# EasyEDA Pro project ProProject_【2023电赛】2023年电赛控制术_2023-08-01.epro, board PCB1
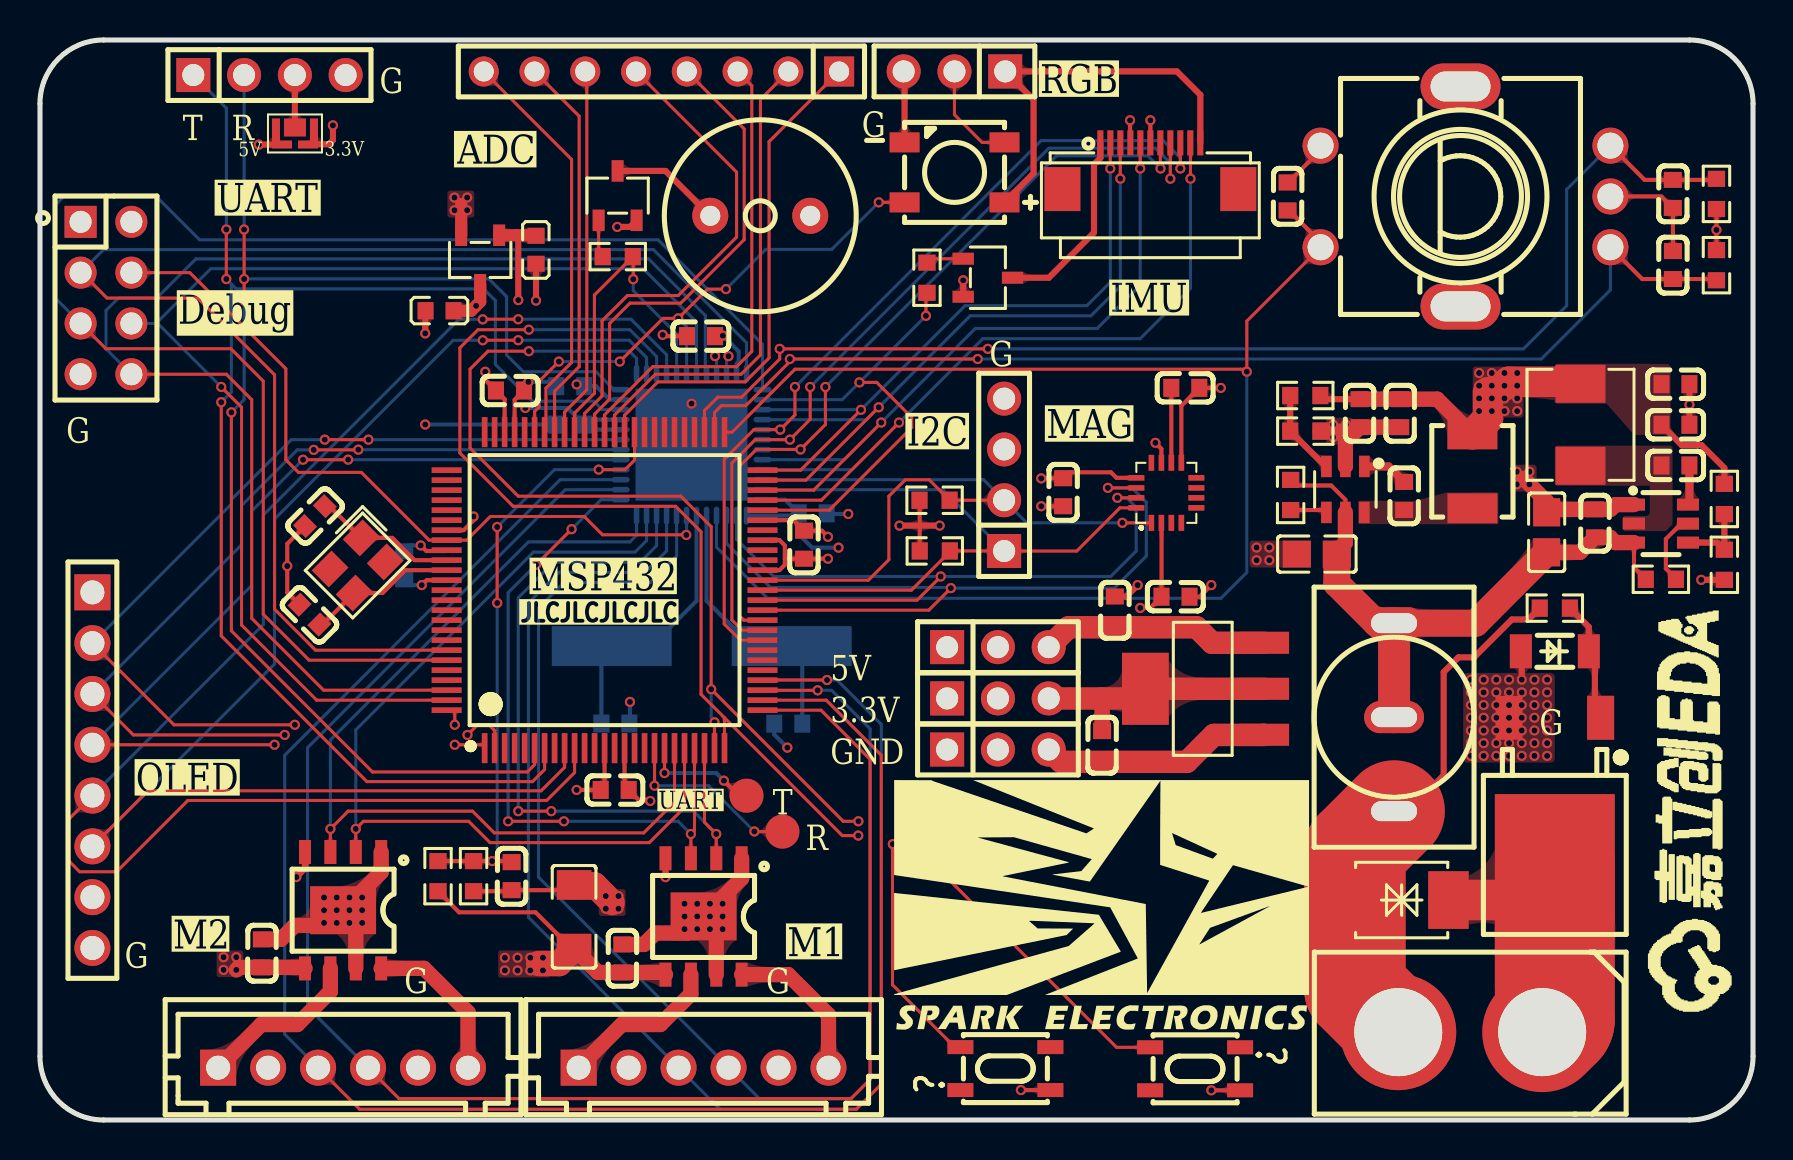
[diagram p6: board, top side]
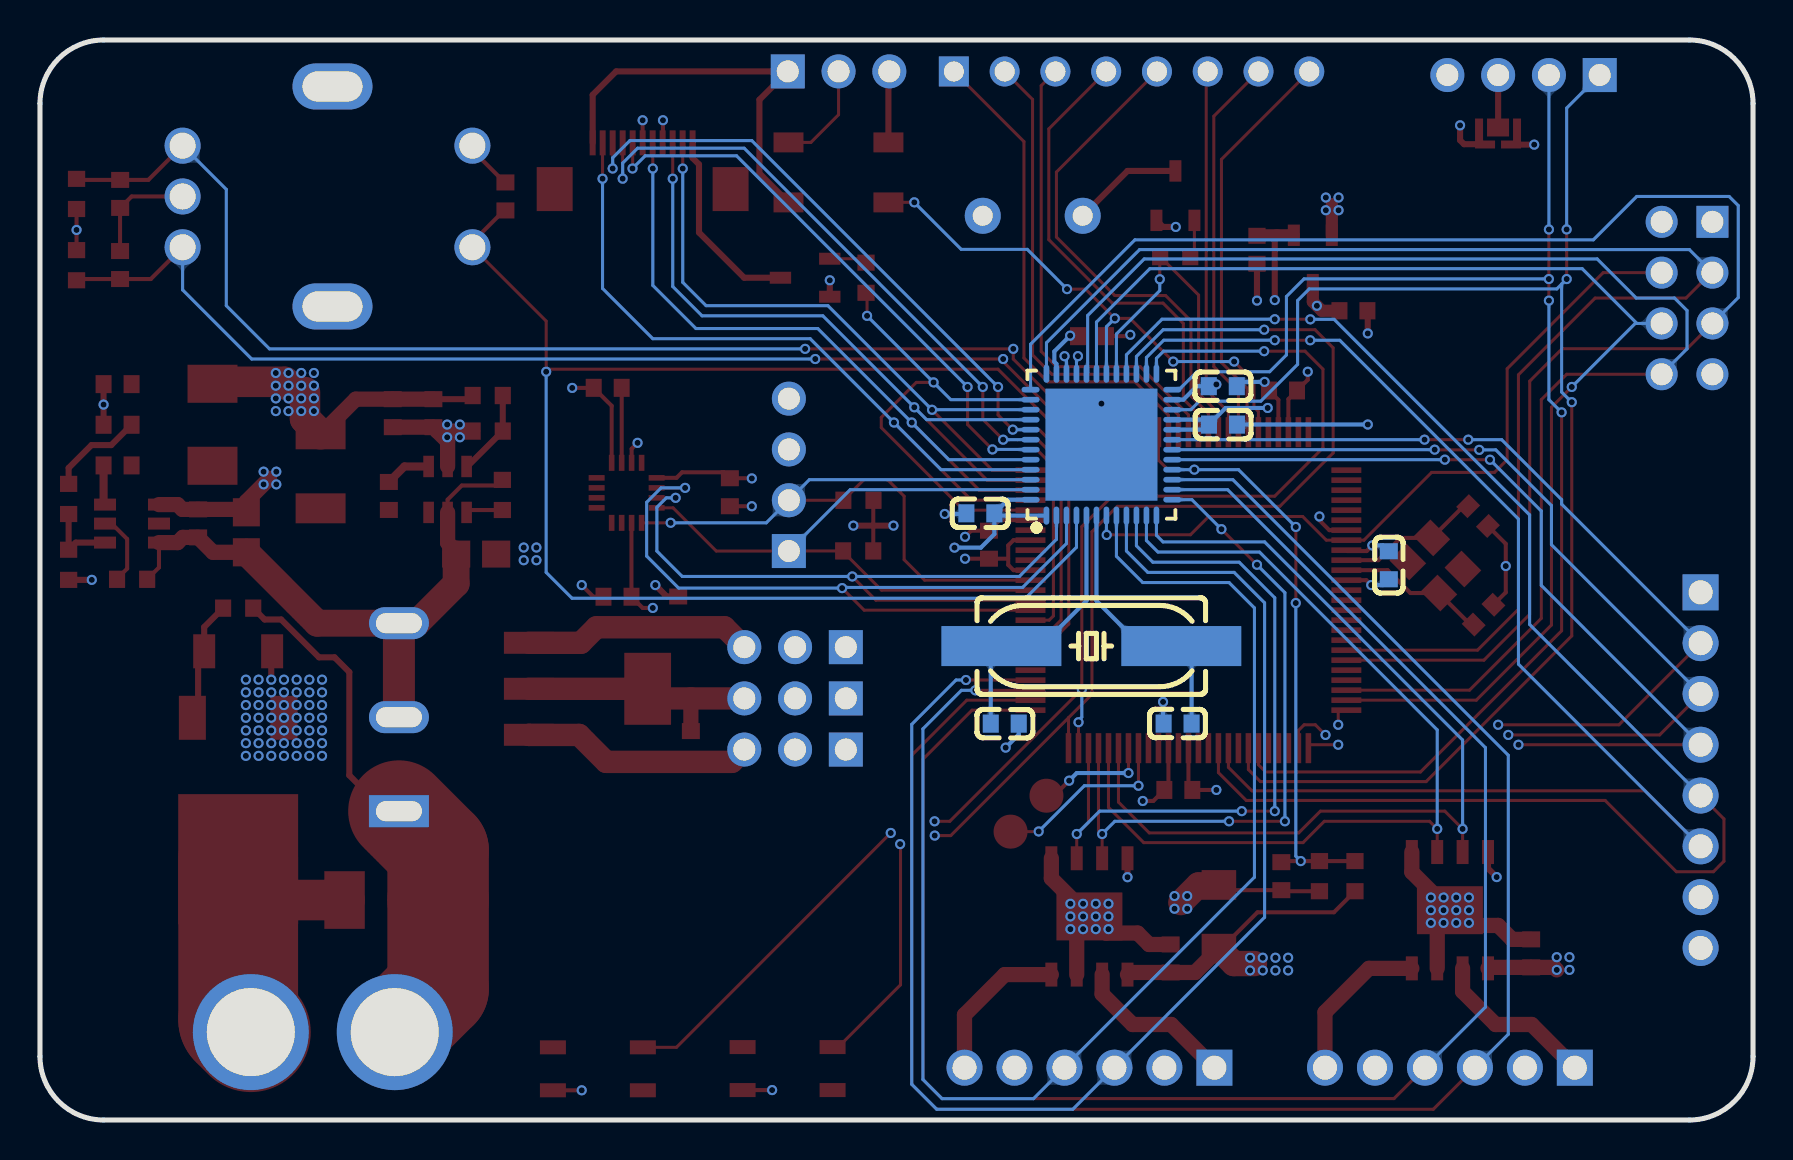
[diagram p7: board, bottom side, seen from below]

Outline 85.7 x 54 mm; copper layers: Top Layer, 电源, 地, Bottom Layer. Coordinates in mm from the lower left corner of the outline.
Outline path: 0,50.82 arc(0.93,53.07) 3.18,54 82.52,54 arc(84.77,53.07) 85.7,50.82 85.7,3.18 arc(84.77,0.93) 82.52,0 3.18,0 arc(0.93,0.93) 0,3.18 0,50.82
Stack: Top Layer 0.035mm 外层铜厚1oz / Dielectric1 0.2104mm 7628 RC49% 8.6mil / 电源 0.0152mm 内层铜厚 / Dielectric2 1.065mm 1.1mm H/HOZ 含铜 / 地 0.0152mm 内层铜厚 / Dielectric3 0.2104mm 7628 RC49% 8.6mil / Bottom Layer 0.035mm 外层铜厚1oz

## Design rules (mm)
template: 自定义配置
spacing copperThickness1oz (default): track to track 0.102, other pairs 0.152 to 0.3
spacing copperThickness2oz: track to track 0.203, other pairs 0.152 to 0.3
track width copperThickness1oz (default): min 0.127, default 0.254, max 100
track width copperThickness2oz: min 0.203, default 0.254, max 2.54
differential pair differentialPair (default): width min 0.127, default 0.254, max 2.54; gap min 0.152, default 0.152
via viaSize (default): diameter min 0.5, default 0.61, max 10; hole min 0.3, default 0.305, max 6.3

## Placement (name value [footprint] x y rotation side)
BUZZER1  3000Hz  [BUZ-TH_BD9.6-P5.00-D0.7-FD]  36.03 45.21 180 top
C1  20pF  [C0603]  13.48 25.27 135 top
C2  20pF  [C0603]  13.76 30.2 225 top
C3  20pF  [C0603]  37.43 19.82 0 bottom
C4  20pF  [C0603]  28.79 19.82 180 bottom
C5  100nF  [C0603]  38.22 28.77 90 top
C6  100nF  [C0603]  18.22 27.74 270 bottom
C7  100nF  [C0603]  26.52 34.77 0 bottom
C8  10uF  [C0603]  33.07 39.19 0 top
C9  100nF  [C0603]  38.65 30.33 180 bottom
C10  100nF  [C0603]  26.53 36.69 0 bottom
C11  100nF  [C0603]  23.51 36.48 180 top
C12  100nF  [C0603]  28.75 16.5 180 top
C13  0.1u  [C0603]  56.81 26.16 0 top
C14  4.7uf  [C0603]  57.3 36.61 0 top
C15  0.1u  [C0603]  51.19 31.39 90 top
C16  0.1u  [C0603]  23.6 12.19 90 top
C17  100nF  [C0603]  81.69 42.75 90 top
C18  100nF  [C0603]  62.41 46.18 270 top
C19  100nF  [C0603]  81.69 46.3 270 top
C20  22uF  [C0805]  75.38 29.39 270 top
C21  100nF  [C0603]  77.79 29.83 270 top
C22  10uF  [C0603]  53.77 25.48 270 top
C23  100nF  [C0603]  68.25 31.2 270 top
C24  22uF  [C0805]  63.88 28.3 0 top
C25  100nF  [C0603]  81.82 32.73 180 top
C26  22uF  [C0603]  66.02 35.34 90 top
C27  10uF  [C0603]  53.14 18.75 90 top
C28  22uF  [C0603]  81.82 34.76 180 top
C29  22uF  [C0603]  68.05 35.34 90 top
C30  22uF  [C0603]  81.82 36.79 180 top
C31  220uf 25v  [C1206]  26.72 10.16 270 top
C32  0.1u  [C0603]  29.13 8.08 270 top
C33  0.1u  [C0603]  11.1 8.33 270 top
CN1  XH2.54-6PIN  [CONN-TH_6P-P2.50-V-M_753]  33.2 2.62 0 top
CN2  XH2.54-6PIN  [CONN-TH_6P-P2.50-V-M_753]  15.16 2.62 0 top
D1  SMBJ15CA  [SMB_L4.5-W3.6-LS5.3-BI]  68.12 11 0 top
D2  ZMM5V1  [LL-34_L3.5-W1.5-RD]  75.78 23.44 180 top
FPC1  0.5K-DX-11PWB  [FPC-SMD_11P-P0.50_DEALON_0.5K-DX-11PWB]  55.55 47.7 0 top
H1  -  [HDR-TH_8P-P2.54-V-F-R2-C4-S2.54-1]  3.3 41.1 270 top
H2  -  [HDR-TH_8P-P2.54-V-F-1]  2.62 17.49 270 top
H3  -  [HDR-TH_4P-P2.54-V-M]  48.23 32.26 90 top
H4  -  [HDR-TH_4P-P2.54-V-M]  11.48 52.25 0 top
H5  -  [HDR-TH_8P-P2.54-V-M]  31.09 52.43 180 top
H6  -  [HDR-TH_3P-P2.54-V-M]  47.92 23.64 0 top
H7  -  [HDR-TH_3P-P2.54-V-M]  47.92 21.08 0 top
H8  -  [HDR-TH_3P-P2.54-V-M]  47.92 18.52 0 top
H9  -  [HDR-TH_3P-P2.54-V-M]  45.75 52.43 180 top
J1  -  [跳线焊盘]  11.41 50.28 0 top
L1  CBG160808U000T  [L0603]  24.82 43.51 90 top
L2  CBG160808U000T  [L0603]  19.99 40.46 0 top
L3  4.7uH  [IND-SMD_L4.5-W4.0-1]  71.66 32.43 90 top
L4  4.7uH  [IND-SMD_L5.4-W5.2]  77.07 34.76 270 top
LED1  XL-5050RGBC-WS2812B  [LED-SMD_4P-L5.0-W5.0-BL_XL-5050RGBC]  45.75 47.38 90 top
Q1  FSS2306  [SOT-23-3_L2.9-W1.6-P1.90-LS2.8-BR]  47.42 42.11 180 top
Q2  FSS2306  [SOT-23-3_L2.9-W1.6-P1.90-LS2.8-BR]  28.9 46.22 270 top
Q3  IRLR7843TRPBF  [TO-252-2_L6.5-W6.1-P4.58-LS10.0-TR]  75.78 16.58 0 top
R1  160R  [R0603]  44.37 42.11 90 top
R2  4.7K  [R0603]  44.76 28.45 0 top
R3  4.7K  [R0603]  44.75 30.99 0 top
R4  330R  [R0603]  83.87 42.74 90 top
R5  330R  [R0603]  83.87 46.3 270 top
R6  160R  [R0603]  28.91 43.17 180 top
R7  30K  [R0603]  19.91 12.19 270 top
R8  10K  [R0603]  21.69 12.19 90 top
R9  10K  [R0603]  62.57 31.25 90 top
R10  100K  [R0603]  75.78 25.59 180 top
R11  10K  [R0603]  81.09 27.04 180 top
R12  270K  [R0603]  63.3 36.22 0 top
R13  50K  [R0603]  63.3 34.44 180 top
R14  54.9K  [R0603]  84.27 31.05 90 top
R15  10K  [R0603]  84.27 27.76 90 top
SW1  TS-1089S-AR02516  [SW-SMD_4P-L4.2-W3.3-P2.15-LS5.1]  48.3 2.57 0 top
SW2  TS-1089S-AR02516  [SW-SMD_4P-L4.2-W3.3-P2.15-LS5.1]  57.79 2.56 0 top
SW3  -  [旋转编码器]  71.04 46.18 90 top
SW4  MB2511S4G01  [KEY-TH_MB2511S4G01]  67.74 20.14 180 top
U1  MSP432P401RIPZR  [QFP-100_L14.0-W14.0-P0.50-LS16.0-BL]  28.25 26.49 0 top
U2  STM32G431CBU6U  [UFQFPN-48_L7.0-W7.0-P0.50-BL-EP5.6]  32.6 33.77 180 bottom
U3  XC6202P332MR  [SOT-23-3_L2.9-W1.6-P1.90-LS2.8-BR]  22.02 43 90 top
U4  -  [VQFN-16_L3.0-W3.0-P0.50-BL-EP1.6]  56.35 31.36 90 top
U5  XT60  [CONN-TH_XT60]  71.55 4.39 180 top
U6  RY8411  [SOT-23-6_L2.9-W1.6-P0.95-LS2.8-TL]  65.31 31.53 270 top
U7  TPS563200DDCR  [SOT-23-6_L2.9-W1.6-P0.95-LS2.8-BR]  81.1 29.82 180 top
U8  AMS1117-3.3  [SOT-223-3_L6.5-W3.4-P2.30-LS7.0-BR]  58.27 21.56 0 top
U9  AT8236  [ESOP-8_L4.9-W3.9-P1.27-LS6.0-BL-EP]  33.2 10.18 180 top
U10  AT8236  [ESOP-8_L4.9-W3.9-P1.27-LS6.0-BL-EP]  15.16 10.49 180 top
U11  -  [2.54 2p触点]  36.25 15.32 135 top
X1  48MHz  [CRYSTAL-SMD_4P-L3.2-W2.5-BL]  15.89 27.73 225 top
X2  8MHz  [HC-49SMD_L11.1-W4.8]  33.1 23.7 180 bottom

## Footprints (pads in the part's own frame, mm; a bottom-side part is the same pattern mirrored in y, then rotated)
2.54 2p触点
  round 1.7 smd: 1(-1.27,0) 2(1.27,0)
BUZ-TH_BD9.6-P5.00-D0.7-FD
  round 1.8 hole 1: 1(-2.5,0) 2(2.5,0)
C0603
  rect 0.8x0.9 smd: 1(-0.7,0) 2(0.7,0)
C0805
  rect 1.41x1.35 smd: 1(-1,0) 2(1,0)
C1206
  rect 1.485x1.728 smd: 1(-1.593,0) 2(1.593,0)
CONN-TH_6P-P2.50-V-M_753
  rect 1.8x1.8 hole 1.2: 1(-6.25,0)
  round 1.8 hole 1.2: 2(-3.75,0) 3(-1.25,0) 4(1.25,0) 5(3.75,0) 6(6.25,0)
CONN-TH_XT60
  round 5.8 hole 4.4: 1(-3.6,0) 2(3.6,0)
CRYSTAL-SMD_4P-L3.2-W2.5-BL
  rect 1.4x1.2 smd: 1(-1.1,-0.85) 2(1.1,-0.85) 3(1.1,0.85) 4(-1.1,0.85)
ESOP-8_L4.9-W3.9-P1.27-LS6.0-BL-EP
  rect 0.6x1.2 smd: 1(-1.905,-2.909) 2(-0.635,-2.909) 3(0.635,-2.909) 4(1.905,-2.909) 5(1.905,2.909) 6(0.635,2.909) 7(-0.635,2.909) 8(-1.905,2.909)
  rect 3.3x2.4 smd: 9(0,0)
FPC-SMD_11P-P0.50_DEALON_0.5K-DX-11PWB
  rect 0.3x1.25 smd: 1(-2.5,1.156) 2(-2,1.156) 3(-1.5,1.156) 4(-1,1.156) 5(-0.5,1.156) 6(0,1.156) 7(0.5,1.156) 8(1,1.156) 9(1.5,1.156) 10(2,1.156) 11(2.5,1.156)
  rect 1.8x2.2 smd: 12(4.4,-1.156) 13(-4.4,-1.156)
HC-49SMD_L11.1-W4.8
  rect 6x2 smd: 1(-4.5,0) 2(4.5,0)
HDR-TH_3P-P2.54-V-M
  rect 1.7x1.7 hole 1.1: 1(-2.54,0)
  round 1.7 hole 1.1: 2(0,0) 3(2.54,0)
HDR-TH_4P-P2.54-V-M
  rect 1.7x1.7 hole 1.1: 1(-3.81,0)
  round 1.7 hole 1.1: 2(-1.27,0) 3(1.27,0) 4(3.81,0)
HDR-TH_8P-P2.54-V-F-1
  rect 1.8x1.8 hole 1.2: 1(-8.89,0)
  round 1.8 hole 1.2: 2(-6.35,0) 3(-3.81,0) 4(-1.27,0) 5(1.27,0) 6(3.81,0) 7(6.35,0) 8(8.89,0)
HDR-TH_8P-P2.54-V-F-R2-C4-S2.54-1
  rect 1.6x1.6 hole 1.1: 1(-3.81,-1.27)
  round 1.6 hole 1.1: 2(-3.81,1.27) 3(-1.27,-1.27) 4(-1.27,1.27) 5(1.27,-1.27) 6(1.27,1.27) 7(3.81,-1.27) 8(3.81,1.27)
HDR-TH_8P-P2.54-V-M
  rect 1.5x1.5 hole 1: 1(-8.89,0)
  round 1.5 hole 1: 2(-6.35,0) 3(-3.81,0) 4(-1.27,0) 5(1.27,0) 6(3.81,0) 7(6.35,0) 8(8.89,0)
IND-SMD_L4.5-W4.0-1
  rect 1.5x2.5 smd: 1(-1.85,0) 2(1.85,0)
IND-SMD_L5.4-W5.2
  rect 1.9x2.5 smd: 1(2.05,0) 2(-2.05,0)
KEY-TH_MB2511S4G01
  rect 2.999x1.6 hole 2.301x1.001: 1(0,4.699)
  oval 2.999x1.6 hole 2.301x1.001: 2(0,0) 3(0,-4.699)
L0603
  rect 0.8x0.864 smd: 1(-0.7,0) 2(0.7,0)
LED-SMD_4P-L5.0-W5.0-BL_XL-5050RGBC
  rect 1x1.5 smd: 1(-1.5,-2.5) 2(1.5,-2.5) 3(1.5,2.5) 4(-1.5,2.5)
LL-34_L3.5-W1.5-RD
  rect 1.1x1.7 smd: 1(-1.7,0) 2(1.7,0)
QFP-100_L14.0-W14.0-P0.50-LS16.0-BL
  rect 0.28x1.5 smd: 1(-6,-7.9) 2(-5.5,-7.9) 3(-5,-7.9) 4(-4.5,-7.9) 5(-4,-7.9) 6(-3.5,-7.9) 7(-3,-7.9) 8(-2.5,-7.9) 9(-2,-7.9) 10(-1.5,-7.9) 11(-1,-7.9) 12(-0.5,-7.9) 13(0,-7.9) 14(0.5,-7.9) 15(1,-7.9) 16(1.5,-7.9) 17(2,-7.9) 18(2.5,-7.9) 19(3,-7.9) 20(3.5,-7.9) 21(4,-7.9) 22(4.5,-7.9) 23(5,-7.9) 24(5.5,-7.9) 25(6,-7.9) 51(6,7.9) 52(5.5,7.9) 53(5,7.9) 54(4.5,7.9) 55(4,7.9) 56(3.5,7.9) 57(3,7.9) 58(2.5,7.9) 59(2,7.9) 60(1.5,7.9) 61(1,7.9) 62(0.5,7.9) 63(0,7.9) 64(-0.5,7.9) 65(-1,7.9) 66(-1.5,7.9) 67(-2,7.9) 68(-2.5,7.9) 69(-3,7.9) 70(-3.5,7.9) 71(-4,7.9) 72(-4.5,7.9) 73(-5,7.9) 74(-5.5,7.9) 75(-6,7.9)
  rect 1.5x0.28 smd: 26(7.9,-6) 27(7.9,-5.5) 28(7.9,-5) 29(7.9,-4.5) 30(7.9,-4) 31(7.9,-3.5) 32(7.9,-3) 33(7.9,-2.5) 34(7.9,-2) 35(7.9,-1.5) 36(7.9,-1) 37(7.9,-0.5) 38(7.9,0) 39(7.9,0.5) 40(7.9,1) 41(7.9,1.5) 42(7.9,2) 43(7.9,2.5) 44(7.9,3) 45(7.9,3.5) 46(7.9,4) 47(7.9,4.5) 48(7.9,5) 49(7.9,5.5) 50(7.9,6) 76(-7.9,6) 77(-7.9,5.5) 78(-7.9,5) 79(-7.9,4.5) 80(-7.9,4) 81(-7.9,3.5) 82(-7.9,3) 83(-7.9,2.5) 84(-7.9,2) 85(-7.9,1.5) 86(-7.9,1) 87(-7.9,0.5) 88(-7.9,0) 89(-7.9,-0.5) 90(-7.9,-1) 91(-7.9,-1.5) 92(-7.9,-2) 93(-7.9,-2.5) 94(-7.9,-3) 95(-7.9,-3.5) 96(-7.9,-4) 97(-7.9,-4.5) 98(-7.9,-5) 99(-7.9,-5.5) 100(-7.9,-6)
R0603
  rect 0.806x0.864 smd: 1(-0.753,0) 2(0.753,0)
SMB_L4.5-W3.6-LS5.3-BI
  rect 2.025x2.883 smd: 1(-2.34,0) 2(2.34,0)
SOT-23-3_L2.9-W1.6-P1.90-LS2.8-BR
  rect 1.07x0.6 smd: 1(1.235,-0.95) 2(1.235,0.95) 3(-1.235,0)
SOT-23-6_L2.9-W1.6-P0.95-LS2.8-BR
  rect 1.1x0.6 smd: 1(1.35,-0.95) 2(1.35,0) 3(1.35,0.95) 4(-1.35,0.95) 5(-1.35,0) 6(-1.35,-0.95)
SOT-23-6_L2.9-W1.6-P0.95-LS2.8-TL
  rect 1.072x0.532 smd: 1(-1.149,0.95) 2(-1.149,0) 3(-1.149,-0.95) 4(1.149,-0.95) 5(1.149,0) 6(1.149,0.95)
SOT-223-3_L6.5-W3.4-P2.30-LS7.0-BR
  rect 2.5x1.1 smd: 1(2.97,-2.3) 2(2.97,0) 3(2.97,2.3)
  rect 2.34x3.6 smd: 4(-2.97,0)
SW-SMD_4P-L4.2-W3.3-P2.15-LS5.1
  rect 1.3x0.701 smd: 1(-2.251,1.075) 2(2.251,1.075) 3(-2.251,-1.075) 4(2.251,-1.075)
TO-252-2_L6.5-W6.1-P4.58-LS10.0-TR
  rect 1.351x2.2 smd: 1(2.291,3.533) 3(-2.291,3.533)
  rect 6x6.5 smd: 4(0,-3.533)
UFQFPN-48_L7.0-W7.0-P0.50-BL-EP5.6
  oval 0.28x0.9 smd: 1(-2.751,-3.547) 2(-2.251,-3.547) 3(-1.75,-3.547) 4(-1.25,-3.547) 5(-0.75,-3.547) 6(-0.249,-3.547) 7(0.249,-3.547) 8(0.75,-3.547) 9(1.25,-3.547) 10(1.75,-3.547) 11(2.251,-3.547) 12(2.751,-3.547) 25(2.751,3.547) 26(2.251,3.547) 27(1.75,3.547) 28(1.25,3.547) 29(0.75,3.547) 30(0.249,3.547) 31(-0.249,3.547) 32(-0.75,3.547) 33(-1.25,3.547) 34(-1.75,3.547) 35(-2.251,3.547) 36(-2.751,3.547)
  oval 0.9x0.28 smd: 13(3.547,-2.75) 14(3.547,-2.25) 15(3.547,-1.75) 16(3.547,-1.25) 17(3.547,-0.75) 18(3.547,-0.25) 19(3.547,0.25) 20(3.547,0.75) 21(3.547,1.25) 22(3.547,1.75) 23(3.547,2.25) 24(3.547,2.75) 37(-3.547,2.751) 38(-3.547,2.251) 39(-3.547,1.75) 40(-3.547,1.25) 41(-3.547,0.75) 42(-3.547,0.249) 43(-3.547,-0.249) 44(-3.547,-0.75) 45(-3.547,-1.25) 46(-3.547,-1.75) 47(-3.547,-2.251) 48(-3.547,-2.751)
  rect 5.6x5.6 smd: 49(0,0)
VQFN-16_L3.0-W3.0-P0.50-BL-EP1.6
  rect 0.8x0.28 smd: 1(-1.501,0.75) 2(-1.501,0.249) 3(-1.501,-0.249) 4(-1.501,-0.75) 9(1.501,-0.75) 10(1.501,-0.249) 11(1.501,0.249) 12(1.501,0.75)
  rect 0.28x0.8 smd: 5(-0.75,-1.501) 6(-0.249,-1.501) 7(0.249,-1.501) 8(0.75,-1.501) 13(0.75,1.501) 14(0.249,1.501) 15(-0.249,1.501) 16(-0.75,1.501)
旋转编码器
  oval 2.301x4 hole 1.501x2.999: 6(5.499,-0.023) 7(-5.499,-0.023)
  round 1.801 hole 1.3: A(-2.54,-7.521) B(2.54,-7.521) C(0,-7.521) D(-2.54,6.977) E(2.54,6.977)
跳线焊盘
  custom 1.1x0.9 smd: 1(1.35,-0.65)
  custom 1x1.5 smd: 2(0.7,-1.5) 3(2,-1.5)

## Nets
As in the schematic.

Pads without a net: FPC1 12 13; H1 2; H2 1; SW1 2 3; SW2 2 3; U1 12 14 41 42 44 92 93; U4 3 4 5 6 7 8 12; X1 2 4

## Via types
v1: diameter 0.508, hole 0.305, Top Layer to Bottom Layer, 257 vias

## Routing (per net, layer and track width the routed paths; a pad name or vN(x,y) marks a point on that pad's centre or on a via; arc(x,y) is an arc through that point)
AVCC: length 51.7
  Top Layer w0.203: U1.45 37.7,29.99 C5.2 39.11,29.47 v1(39.42,29.16) ; U1.87 19.35,26.99 v1(19.1,26.75)
  Top Layer w0.305: v1(24.82,40.97) L1.1
  电源 w0.305: 28.43,37.36 36.63,29.16 v1(39.42,29.16) ; 28.43,37.36 v1(24.82,40.97) ; 28.43,37.36 28.43,37.34 26.69,35.6 v1(24.28,35.6) 24.28,29.61 21.41,26.75 v1(19.1,26.75)
  Bottom Layer w0.203: C6.2 18.51,26.75 v1(19.1,26.75) ; v1(24.28,35.6) 26.39,35.6 C7.2 ; C7.2 27.47,34.52 U2.20 ; C7.2 27.46,35.02 U2.21
AVSS: length 66.2
  Top Layer w0.203: U1.43 37,28.99 37.26,28.73 37.26,27.76 37,27.49 U1.40 ; v1(19.27,34.77) 19.27,34.78 19.22,34.78 ; v1(39.42,28.06) C5.1 37.26,28.06 ; v1(19.05,28.73) 19.33,28.45 20.3,28.45 U1.84
  Top Layer w0.305: v1(19.27,39.33) 19.27,40.45 L2.1
  电源 w0.305: v1(39.42,28.06) 35.41,28.06 27.99,20.65 27.99,16.59 27.23,15.82 26.47,15.82 25.7,16.59 25.7,19 23.04,21.67 19.23,21.67 17.65,23.24 17.65,27.33 v1(19.05,28.73) 19.27,28.95 v1(19.27,39.33)
  Bottom Layer w0.203: v1(19.27,34.77) 25.81,34.77 C7.1 ; C6.1 18.51,28.73 v1(19.05,28.73)
D3.3V: length 280.9
  Top Layer w0.203: FPC1.6 v1(55.55,49.99) ; v1(55.04,25.6) 55.55,25.6 C13.1 56.11,29.85 U4.2 ; R2.1 44.01,30.98 R3.1 ; R4.2 v1(83.87,44.5) R5.2 ; U4.13 53.86,32.11 53.58,32.39 51.48,32.39 C15.2 50.1,32.09 v1(50.09,32.08)
  Top Layer w0.305: v1(43,29.72) 44,29.72 44.01,29.73 44.03,29.72 v1(45.01,29.72) ; v1(14.66,49.73) 14.66,48.99 14.46,48.79 13.68,48.79 ; v1(12.82,12.15) 13.26,12.58 U10.4 ; U9.4 v1(31.29,12.14)
  Top Layer w0.762: 53.14,21.08 53.14,21.08 53.14,19.44
  Top Layer w1.117: H7.3 54.82,21.08 U8.4 U8.2
  电源 w0.508: 52.25,28.4 52.25,29.92 v1(50.09,32.08) ; 52.25,28.4 v1(55.04,25.6) ; 52.25,28.4 50.72,26.87 46.91,26.87 46.03,27.76 46.03,28.7 v1(45.01,29.72) ; v1(55.55,49.99) 56.06,50.5 66.6,50.5 78.34,38.75 78.73,38.75 83.87,43.89 v1(83.87,44.5) ; v1(43,29.72) 42.22,29.72 42.15,29.78
  电源 w0.61: v1(14.66,49.73) 10.46,49.73 9.32,48.59 9.32,47.07 ; H2.7 8.1,5.66 14.46,5.66 ; 14.46,5.66 26.4,5.66 CN1.2 ; 14.46,5.66 CN2.2
  电源 w0.762: H7.3 61.11,21.08 78.35,38.31 78.35,38.75 ; H1.1 2.04,44.91 3.85,46.72 8.97,46.72 9.32,47.07 9.64,46.75 11.04,46.75 14.43,43.36 34.75,43.36 40.18,37.93 40.18,33.86 42.15,31.89 42.15,24.31 H7.1 44.17,21.08 35.23,12.14 v1(31.29,12.14) 3.62,12.14 H2.7
  电源 w1.778: H7.1 H7.2 H7.3
D5V: length 161.9
  Top Layer w0.305: FPC1.11 58.05,51.26 56.88,52.43 H9.1 49.71,51.01 49.71,47.33 LED1.1 ; 84.27,31.81 84.27,32.6 83.12,33.75 82.13,33.75 C28.2 ; v1(10.95,48.77) 12.1,48.77 J1.2 ; R12.2 64.24,36.04 C26.2
  Top Layer w0.61: U3.2 21.07,45.8
  Top Layer w0.762: C26.2 C29.2 69.9,36.04 L3.2
  Top Layer w1.117: H6.3 51.46,24.64 57.86,24.64 58.64,23.86 U8.3
  Top Layer w1.524: L3.2 72.44,35.06 72.44,36.4 ; v1(73.27,36.72) 73.46,36.91 76.97,36.91 L4.2
  电源 w0.508: v1(20.74,46.12) 20.74,46.14 18.11,48.77 v1(10.95,48.77)
  电源 w0.61: 44.03,33.55 44.05,33.53 H3.3
  电源 w1.016: 44.03,37.32 44.03,25 H6.1 ; 44.03,37.32 38.53,42.81 BUZZER1.1 36.68,47.07 22.33,47.07 21.06,45.8 ; 44.03,37.32 48.29,41.58 H9.1
  电源 w1.778: 72.82,35.89 60.57,23.64 H6.3 H6.2 H6.1
  vias: v1(20.74,45.49) v1(21.37,46.12) v1(21.37,45.49) v1(72,37.35) v1(72,36.72) v1(72,36.08) v1(72,35.45) v1(72.63,37.35) v1(72.63,36.72) v1(72.63,36.08) v1(72.63,35.45) v1(73.27,37.35) v1(73.27,36.08) v1(73.27,35.45) v1(73.9,37.35) v1(73.9,36.72) v1(73.9,36.08) v1(73.9,35.45)
D12V: length 31.9
  Top Layer w0.203: U7.3 79.75,27.63 R11.2 ; R9.2 62.85,31.72 64.6,31.72 65.31,31.02 U6.5
  Top Layer w0.762: U6.5 65.31,28.86 64.88,28.44 C24.2 ; C20.2 77.04,28.39 C21.2 78.56,29.13 78.81,28.87 U7.3
  Top Layer w1.346: C24.2 64.88,26.81 66.85,24.84 SW4.3 71.83,24.84 C20.2
  Top Layer w1.6: SW4.2 SW4.3
DVCC: length 89.6
  Top Layer w0.203: v1(26.85,16.5) 28.05,16.5 28.25,16.7 U1.13 ; v1(22.28,37.41) 22.28,37.01 C11.2 23.25,36.04 U1.73 ; 33.77,39.19 34.14,39.19 v1(34.16,39.22)
  Top Layer w0.305: v1(23.93,41) 23.93,44.13 23.82,44.24
  Top Layer w0.61: U3.1 24.79,44.24 L1.2
  电源 w0.305: v1(39.95,28.62) 40.18,28.85 40.18,29.49 33.11,36.56 33.11,38.6 33.73,39.22 v1(34.16,39.22) ; v1(26.85,36.78) 26.34,36.27 22.28,36.27 ; v1(34.16,39.22) 32.61,40.77 29.84,40.77 29.01,41.61 24.54,41.61 v1(23.93,41) 23.04,40.11 23.04,38.18 v1(22.28,37.41) 22.28,36.27 ; v1(34.16,39.22) 34.11,39.16 ; v1(26.85,16.5) 26.85,19 23.42,22.43 19.48,22.43 18.34,23.57 18.34,27 18.97,27.64 20.88,27.64 22.28,29.03 22.28,36.27
  Bottom Layer w0.203: v1(26.85,36.78) 27.14,36.78 C10.2 27.82,36.69 28.5,36.02 U2.23 ; U2.48 37.27,31.02 C9.2 ; 34.85,37.32 34.85,37.81 34.95,37.91 34.95,38.43 v1(34.16,39.22) ; C9.2 37.95,29.29 38.63,28.62 v1(39.95,28.62) ; C9.2 37.84,30.22 U2.1
GND: length 108.6
  Top Layer w0.203: C2.2 12.37,28.81 v1(12.37,27.7) 12.37,26.38 12.99,25.76 ; SW1.4 v1(49.07,1.5) ; U1.15 29.25,16.71 C12.1 30,15.95 v1(30.53,15.95) ; v1(24.44,36.91) 24.21,36.68 C11.1 23.75,36.01 U1.72 ; C31.1 26.46,11.49 C16.1 23.54,11.44 R8.1 ; v1(31.15,39.26) 31.22,39.19 32.37,39.19 ; v1(21.69,30.17) 21.69,29.99 21.2,29.49 U1.82 ; v1(55.8,33.86) 56.1,33.56 U4.11 ; FPC1.4 54.53,48.87 v1(54.53,49.99) ; C17.2 81.69,45.6 C19.2 81.11,46.18 78.56,46.18 ; v1(58.6,1.49) 60.04,1.49 ; v1(59.07,36.6) 58,36.6 C14.2 57.1,35.71 U4.9 ; C13.2 58.02,26.16 v1(58.6,26.75) ; 62.41,46.88 62.45,46.88 64.07,48.5 64.07,48.72 ; C15.1 v1(50.09,30.69)
  Top Layer w0.305: 72.9,22.06 v1(72.86,22.02) ; v1(54.91,26.75) 54.34,26.18 C22.1 ; C30.1 v1(82.52,35.77) C28.1 ; H9.3 43.25,52.39 LED1.3 ; Q1.2 v1(46.19,41.99) ; 29.85,44.98 29.52,44.65 v1(28.88,44.65) ; v1(74.13,22.02) 74.13,23.39 D2.2 ; 84.27,27.01 v1(83.11,27.01)
  Top Layer w0.61: L2.2 21.57,40.46 v1(21.82,40.71) 22.02,40.91 U3.3
  Top Layer w0.762: U9.1 35.1,12.08 U9.9 ; 74.22,32.08 75.38,30.92 C20.1 75.52,30.53 C21.1 78.57,30.53 78.81,30.77 U7.1 ; U9.9 32.37,9.35 30.78,9.35 30.22,8.78 C32.1 ; U9.9 33.83,9.54 U9.7 ; U10.1 17.07,12.39 U10.9 ; U6.2 65.31,33.93 65.82,34.44 ; R13.1 65.82,34.44 ; 65.82,34.44 C26.1 C29.1 ; U10.7 15.8,9.86 U10.9 ; U10.9 14.4,9.73 12.75,9.73 12.05,9.03 11.1,9.03
  Top Layer w1.117: H8.3 51.08,17.91 57.38,17.91 58.72,19.25 61.23,19.25 U8.1
  Top Layer w1.27: 28.63,10.87 27.74,11.75 C31.1
  Bottom Layer w0.203: C4.1 29.51,19.85 v1(29.51,20.9) ; v1(50.09,30.69) 50.09,30.68 ; C9.1 39.39,30.3 v1(40.44,30.3) ; v1(24.44,36.91) 25.61,36.91 C10.1 ; v1(37.39,18.62) 36.73,19.27 C3.1
  vias: v1(14.21,11.12) v1(14.21,10.49) v1(14.21,9.86) v1(14.85,11.12) v1(14.85,10.49) v1(14.85,9.86) v1(15.48,11.12) v1(15.48,10.49) v1(15.48,9.86) v1(16.12,11.12) v1(16.12,10.49) v1(16.12,9.86) v1(28.31,11.2) v1(28.31,10.56) v1(28.94,11.2) v1(28.94,10.56) v1(32.25,10.81) v1(32.25,10.18) v1(32.25,9.54) v1(32.6,35.82) v1(32.88,10.81) v1(32.88,10.18) v1(32.88,9.54) v1(33.52,10.81) v1(33.52,10.18) v1(33.52,9.54) v1(34.15,10.81) v1(34.15,10.18) v1(34.15,9.54) v1(60.86,28.62) v1(60.86,27.99) v1(61.5,28.62) v1(61.5,27.99) v1(64.69,34.77) v1(64.69,34.14) v1(65.33,34.77) v1(65.33,34.14) v1(71.59,22.02) v1(71.59,21.38) v1(71.59,20.75) v1(71.59,20.11) v1(71.59,19.48) v1(71.59,18.84) v1(71.59,18.21) v1(72.22,22.02) v1(72.22,21.38) v1(72.22,20.75) v1(72.22,20.11) v1(72.22,19.48) v1(72.22,18.84) v1(72.22,18.21) v1(72.86,21.38) v1(72.86,20.75) v1(72.86,20.11) v1(72.86,19.48) v1(72.86,18.84) v1(72.86,18.21) v1(73.49,22.02) v1(73.49,21.38) v1(73.49,20.75) v1(73.49,20.11) v1(73.49,19.48) v1(73.49,18.84) v1(73.49,18.21) v1(73.88,32.42) v1(73.88,31.78) v1(74.13,21.38) v1(74.13,20.75) v1(74.13,20.11) v1(74.13,19.48) v1(74.13,18.84) v1(74.13,18.21) v1(74.51,32.42) v1(74.51,31.78) v1(74.76,22.02) v1(74.76,21.38) v1(74.76,20.75) v1(74.76,20.11) v1(74.76,19.48) v1(74.76,18.84) v1(74.76,18.21) v1(75.4,22.02) v1(75.4,21.38) v1(75.4,20.75) v1(75.4,20.11) v1(75.4,19.48) v1(75.4,18.84) v1(75.4,18.21)
ACCCS_PC11: length 35.2
  Top Layer w0.152: v1(54.04,47.07) 54.04,48.85 FPC1.3 ; U1.49 38.32,31.99 v1(41.96,35.64)
  Bottom Layer w0.152: U2.40 41.34,35.02 v1(41.96,35.64) 46.53,40.21 52.58,40.21 54.04,41.68 v1(54.04,47.07)
ACCEXT_PC10: length 33.2
  Top Layer w0.152: U1.50 38.06,32.49 v1(41.07,35.51) ; FPC1.2 53.54,48.85 v1(53.54,47.57)
  Bottom Layer w0.152: v1(53.54,47.57) 53.54,41.89 52.38,40.72 46.28,40.72 41.08,35.52 ; v1(41.07,35.51) 41.08,35.52 ; 41.08,35.52 U2.39
ADCBAT_PC4: length 31.3
  Top Layer w0.152: v1(27.95,32.52) 29.27,32.52 29.75,32.99 U1.60 29.77,34.37 ; v1(22.87,25.85) 22.87,25.85 22.87,29.65 v1(22.87,29.65)
  Top Layer w0.203: C16.2 23.54,12.94 v1(22.63,12.94) 19.91,12.94
  Bottom Layer w0.152: v1(22.87,29.65) 25.74,32.52 U2.16 ; v1(22.63,12.94) 22.87,13.19 v1(22.87,25.85)
B12V: length 105.9
  Top Layer w0.203: C31.2 26.61,8.57 24.79,10.39 20.97,10.39 R7.2
  Top Layer w0.305: SW4.1 68.43,15.44 70.23,17.24 70.23,22.4 70.96,23.13 71.74,23.13 73.63,25.03 74.46,25.03 R10.2
  Top Layer w0.762: U10.5 13.21,7.63 C33.2 ; U9.5 31.19,7.38 C32.2 27.91,7.38 C31.2 ; v1(9.82,7.51) 9.95,7.63 11.07,7.63
  Top Layer w1.27: 24.94,7.82 25.98,7.82 C31.2
  Top Layer w5.08: U5.2 65.78,6.56 D1.1 65.78,13.48 SW4.1
  电源 w1.778: U5.2 64.52,7.82 9.45,7.82
  vias: v1(9.18,8.14) v1(9.18,7.51) v1(9.82,8.14) v1(23.26,8.11) v1(23.26,7.48) v1(23.89,8.11) v1(23.89,7.48) v1(24.53,8.11) v1(24.53,7.48) v1(25.16,8.11) v1(25.16,7.48)
BTN1_PC15: length 77.5
  Top Layer w0.152: U1.51 34.62,34.39 37.77,37.54 60.25,37.54 v1(60.38,37.41) 60.38,39.95 SW3.D
  Top Layer w0.203: SW3.D 64.07,43.89 62.48,45.48 C18.2
  Bottom Layer w0.152: U2.4 33.85,28.64 36.4,26.09 59.08,26.09 60.38,27.38 v1(60.38,37.41)
BTN2_PB14: length 64.7
  Top Layer w0.152: SW1.1 45.76,3.65 42.65,6.76 42.65,13.77 v1(42.67,13.79) ; v1(40.94,14.22) 40.13,14.22 34.25,20.11 ; U1.25 34.25,20.11 ; 34.25,20.11 33.07,21.28 33.07,29.41 31.8,30.68 23.67,30.68 21.01,33.35 21.01,38.61 21.91,39.52 v1(24.46,39.52)
  电源 w0.152: v1(42.67,13.79) 42.67,13.8 42.24,14.22 v1(40.94,14.22)
  Bottom Layer w0.152: U2.27 30.85,38.17 29.51,39.51 24.46,39.51
BTN3_PB12: length 67.9
  Top Layer w0.152: v1(43.14,14.35) 53.86,3.63 SW2.1 ; v1(24.46,38.44) 22.41,38.44 21.51,37.54 21.51,33.6 23.93,31.19 32.06,31.19 33.58,29.67 v1(33.58,21.54) 40.18,14.94 v1(40.94,14.94) ; U1.24 v1(33.75,19.89)
  电源 w0.152: v1(40.94,14.94) 42.56,14.94 43.14,14.36 v1(43.14,14.35)
  Bottom Layer w0.152: 24.46,38.44 29.49,38.44 29.85,38.08 U2.25 ; v1(33.58,21.54) 33.58,20.14 33.83,19.89 v1(33.75,19.89)
BUZZ_PC6: length 16.7
  Top Layer w0.152: v1(29.68,42.04) 29.68,43.15 R6.1 27.74,41.25 27.74,36.34 26.75,35.34 U1.66
  Bottom Layer w0.152: v1(29.68,42.04) 29.68,41.47 31.85,39.3 U2.29
DIR1_PA5: length 34
  Top Layer w0.152: v1(26.59,29.54) v1(24.82,27.76) ; U1.22 32.75,14.48 v1(32.56,14.3) 32.56,13.09 ; v1(23.42,14.94) v1(26.21,14.94)
  Bottom Layer w0.152: v1(23.42,14.94) 23.42,26.36 v1(24.82,27.76) ; U2.13 28.07,31.02 v1(26.59,29.54) ; v1(26.21,14.94) 31.93,14.94 v1(32.56,14.3)
DIR2_PA4: length 47.5
  Top Layer w0.152: U1.20 31.75,15.89 30.21,14.36 22.73,14.36 21.64,15.44 15.42,15.44 v1(14.53,14.55) 14.53,13.4
  Bottom Layer w0.152: U2.12 29.85,29.24 29.51,28.91 24.44,28.91 14.53,19 v1(14.53,14.55)
ENCOA1_PA0: length 68.8
  Top Layer w0.152: U1.28 36.15,21.48 v1(38.91,21.48)
  Bottom Layer w0.152: v1(38.91,21.48) 39.6,21.48 41.53,19.56 41.53,2.03 40.57,1.07 36,1.07 CN1.4 34.45,2.64 24.94,12.14 24.94,25.6 26.21,26.87 30.53,26.87 31.85,28.19 U2.8
ENCOA2_PA6: length 86.8
  Top Layer w0.152: CN2.4 17.96,1.07 40.57,1.07 41.53,2.03 41.53,18.03 39.07,20.49 U1.26
  Bottom Layer w0.152: U2.14 26.28,31.52 13.39,18.62 13.39,5.64 CN2.4
ENCOA3_PA11: length 66.1
  Top Layer w0.152: v1(47.42,38.56) v1(37.01,38.56) 37.01,38.05 35.1,36.14 33.91,36.14 33.25,35.48 U1.53
  Top Layer w0.203: R5.1 83.82,47 C19.1 80.28,47 78.56,48.72
  电源 w0.152: v1(33.77,38.19) 33.77,38.24 34.21,38.68 36.88,38.68 v1(37.01,38.56)
  Bottom Layer w0.152: U2.33 33.85,38.19 v1(33.77,38.19) ; v1(47.42,38.56) 74.22,38.56 76.38,40.72 76.38,46.53 78.56,48.72
ENCOB1_PA1: length 72.5
  Top Layer w0.152: U1.29 36.15,22 v1(39.37,22)
  Bottom Layer w0.152: U2.9 31.35,28.45 30.28,27.38 25.96,27.38 24.44,25.86 24.44,10.13 31.95,2.62 CN1.3 34.03,0.54 40.84,0.54 42.09,1.79 42.09,19.78 39.87,22 v1(39.37,22)
ENCOB2_PA7: length 91.9
  Top Layer w0.152: U1.27 39.33,20.99 42.09,18.24 42.09,1.79 40.83,0.54 15.99,0.54 CN2.3
  Bottom Layer w0.152: CN2.3 12.24,4.29 12.24,18.24 26.02,32.02 U2.15
ENCOB3_PA12: length 60.6
  Top Layer w0.152: v1(46.91,38.05) v1(37.52,38.05) 37.52,37.92 35.31,35.72 34.09,35.72 33.75,35.37 U1.52
  Top Layer w0.203: 78.56,43.64 80.15,42.05 C17.1 83.81,42.05 R4.1
  电源 w0.152: v1(34.44,38.19) 34.59,38.05 v1(37.52,38.05)
  Bottom Layer w0.152: U2.34 34.35,38.19 v1(34.44,38.19) ; 78.56,43.64 78.56,41.51 75.11,38.05 v1(46.91,38.05)
GRAY_ADC1: length 25
  Top Layer w0.152: U1.61 29.25,35.24 30.91,36.91 35.28,36.91 36.47,38.1 36.47,48.92 H5.1
GRAY_ADC2: length 24.1
  Top Layer w0.152: H5.2 36.04,51.03 36.04,38.25 35.08,37.29 30.78,37.29 28.75,35.25 U1.62
GRAY_ADC3: length 23.8
  Top Layer w0.152: H5.3 35.61,51.71 35.61,38.43 34.85,37.67 30.66,37.67 28.25,35.25 U1.63
GRAY_ADC4: length 23.8
  Top Layer w0.152: U1.64 27.75,35.29 28.5,36.05 28.5,39.83 29.51,40.84 32.06,40.84 35.23,44.02 35.23,49.56 H5.4
GRAY_ADC5: length 24.8
  Top Layer w0.152: U1.65 27.25,35.32 28.12,36.2 28.12,39.95 29.39,41.22 31.93,41.22 34.85,44.14 34.85,47.4 H5.5
GRAY_ADC6: length 18.5
  Top Layer w0.152: H5.6 27.36,52.35 27.36,36.51 26.25,35.39 U1.67
GRAY_ADC7: length 19.5
  Top Layer w0.152: U1.68 25.75,36.44 26.97,37.67 26.97,50.19 H5.7
GYROCS_PB7: length 40.9
  Top Layer w0.152: FPC1.10 57.56,48.85 v1(57.56,47.07) ; U1.47 39.09,30.99 v1(42.98,34.87)
  Bottom Layer w0.152: 36.14,32.52 40.62,32.52 v1(42.98,34.87) 47.17,39.06 55.04,39.06 57.56,41.58 v1(57.56,47.07)
GYROEXT_PB6: length 37
  Top Layer w0.152: U1.48 38.71,31.49 v1(42.09,34.87) ; FPC1.5 55.04,48.85 v1(55.04,47.57)
  Bottom Layer w0.152: v1(55.04,47.57) 55.04,41.73 52.88,39.57 46.79,39.57 v1(42.09,34.87) 40.23,33.02 U2.44
I2CSCL_PB8: length 36.8
  Top Layer w0.152: v1(54.15,29.86) 54.15,29.86 55.6,29.86 ; H3.2 R3.2 44.48,32.01 43.29,32.01 42.47,31.19 42.47,28.02 41.44,26.99 U1.39
  Bottom Layer w0.152: v1(54.15,29.86) 49.36,29.86 H3.2 47.21,32.02 U2.46
I2CSDA_PB9: length 33.8
  Top Layer w0.152: U4.16 54.03,30.61 51.87,28.45 H3.1 48.23,28.45 R2.2 45.52,28.41 43.6,26.49 U1.38
  Bottom Layer w0.152: H3.1 45.17,31.52 U2.47
MAGEXT_PC13: length 36.2
  Top Layer w0.152: 45,27.13 45.01,27.13 v1(45.06,27.18) ; 45,27.13 45,27.11 43.88,25.99 U1.37 ; 45,27.13 44.98,27.13 ; U4.15 v1(53.9,31.11)
  Bottom Layer w0.152: U2.2 34.85,29.03 36.7,27.18 v1(45.06,27.18) 53.57,27.18 54.84,28.45 54.84,30.63 54.36,31.11 v1(53.9,31.11)
MAGRST_PC14: length 40.2
  Top Layer w0.152: U1.36 44.47,25.49 v1(45.57,26.59) ; v1(53.43,31.61) U4.14
  Bottom Layer w0.152: v1(53.43,31.61) 54.63,31.61 55.35,30.88 55.35,28.2 53.75,26.59 v1(45.57,26.59) 45.54,26.63 36.54,26.63 34.35,28.82 U2.3
MOTOR1_PA2: length 36.3
  Top Layer w0.152: v1(25.58,15.44) v1(23.93,15.44) ; U9.2 v1(33.83,14.3) 33.25,14.89 U1.23
  Bottom Layer w0.152: v1(25.58,15.44) 32.69,15.44 v1(33.83,14.3) ; v1(23.93,15.44) 23.93,26.11 25.7,27.89 30.02,27.89 30.85,28.71 U2.10
MOTOR2_PA3: length 46.6
  Top Layer w0.152: U10.2 v1(15.8,14.55) 16.18,14.94 21.45,14.94 22.51,13.87 30.48,13.87 32.25,15.63 U1.21
  Bottom Layer w0.152: v1(15.8,14.55) 15.8,19.51 24.69,28.4 29.77,28.4 30.35,28.97 U2.11
NRST: length 37.8
  Top Layer w0.152: H1.4 7.49,42.37 12.3,37.56 12.3,33.01 12.93,32.38 16.08,32.38 19.47,28.99 U1.83 21.35,28.99 22.53,30.17 27.23,30.17 28.14,29.26 32.34,29.26
  Bottom Layer w0.152: U2.7 32.35,29.27 v1(32.34,29.25)
OLEDCS_PB2: length 51.7
  Top Layer w0.152: v1(20.75,19.76) 20.75,20.47 20.73,20.49 U1.100 ; v1(12.75,19.76) 6.7,19.76 H2.2 ; v1(14.25,34.02) v1(16.43,34.02)
  电源 w0.152: v1(20.75,19.76) v1(12.75,19.76)
  Bottom Layer w0.152: v1(14.25,34.02) 12.58,34.02 9.58,31.02 9.58,30.8 H2.2 ; U2.19 v1(16.43,34.02)
OLEDDC_PB1: length 54.9
  Top Layer w0.152: v1(12.24,19.25) 4.67,19.25 H2.3 ; v1(21.39,19.25) 21.89,19.76 22.46,19.76 22.75,19.47 U1.2 ; v1(15.93,33.52) 15.93,33.48 15.9,33.51 v1(13.7,33.51)
  电源 w0.152: v1(12.24,19.25) v1(21.39,19.25)
  Bottom Layer w0.152: U2.18 v1(15.93,33.52) ; v1(13.7,33.51) 12.87,33.51 10.08,30.72 10.08,28.76 H2.3
OLEDRST_PB0: length 54.3
  Top Layer w0.152: v1(15.42,33.02) 15.41,33.01 v1(13.16,33.01) ; U1.1 22.25,18.76 v1(20.75,18.76) ; v1(11.73,18.76) H2.4
  电源 w0.152: v1(20.75,18.76) v1(11.73,18.76)
  Bottom Layer w0.152: U2.17 v1(15.42,33.02) ; H2.4 10.59,26.73 10.59,30.45 13.16,33.01 v1(13.16,33.01)
P12: length 70
  Top Layer w0.152: v1(10.21,44.53) 10.21,44.52 v1(10.21,42.05) 10.21,40.97 v1(10.21,40.97) ; v1(9.58,35.38) 9.58,24.46 16.63,17.4 24.38,17.4 24.75,17.77 U1.6
  Bottom Layer w0.152: U2.24 28.72,36.52 27.82,37.41 24.18,37.41 23.34,38.25 23.34,41.17 22.46,42.06 10.22,42.06 v1(10.21,42.05) ; H4.2 v1(10.21,44.53) ; v1(9.58,35.38) 10.21,36.02 v1(10.21,40.97)
P13: length 73.5
  Top Layer w0.152: U1.7 25.25,17.52 24.64,16.92 16.35,16.92 9.07,24.21 v1(9.07,35.89) ; v1(9.32,44.53) 9.32,44.53 v1(9.32,42.05)
  Bottom Layer w0.152: U2.22 28.12,35.52 27.7,35.94 24.62,35.94 22.78,37.78 22.78,40.97 22.2,41.56 9.81,41.56 9.58,41.79 ; v1(9.32,44.53) 9.32,50.59 H4.1 ; v1(9.07,35.89) 9.58,36.4 9.58,41.79 ; v1(9.32,42.05) 9.58,41.79
P15: length 69.8
  Top Layer w0.152: H2.6 5.4,16.46 25.07,16.46 26.25,17.63 U1.9 ; v1(23.93,38.99) 22.16,38.99 v1(22.15,38.99)
  Bottom Layer w0.152: U2.26 30.35,38.12 29.48,38.99 23.93,38.99 ; H2.6 11.73,22.79 11.73,30.05 20.67,38.99 v1(22.15,38.99)
P16: length 76
  Top Layer w0.152: U1.10 26.75,17.37 25.35,15.98 7.4,15.98 3.83,12.41 1.98,12.41 1.45,12.94 1.45,15.05 H2.5 ; v1(22.15,40.03) 22.15,40.04 v1(23.93,40.04)
  Bottom Layer w0.152: 23.93,40.04 29.57,40.04 31.35,38.26 U2.28 ; v1(22.15,40.03) 20.96,40.03 11.18,30.25 11.18,24.78 H2.5
P31: length 43.8
  Top Layer w0.152: FPC1.9 v1(57.05,47.57) ; U1.33 35.04,23.99 34.23,24.8 34.23,33.03 35.72,34.52 v1(37.03,34.52) 37.77,35.25 v1(37.77,36.65)
  Bottom Layer w0.152: U2.41 36.15,34.52 v1(37.03,34.52) ; v1(57.05,47.57) 57.05,48.11 56.19,48.97 50.09,48.97 v1(37.77,36.65)
P32: length 43.2
  Top Layer w0.152: U1.34 35.12,24.49 34.61,25 34.61,32.85 35.78,34.02 v1(37.52,34.02) 38.53,35.03 v1(38.53,36.65) ; v1(56.55,47.07) FPC1.8
  Bottom Layer w0.152: U2.42 v1(37.52,34.02) ; v1(38.53,36.65) 50.47,48.59 55.8,48.59 56.55,47.84 v1(56.55,47.07)
P33: length 40.8
  Top Layer w0.152: v1(56.06,47.57) 56.05,47.58 FPC1.7 ; U1.35 35.21,24.99 35,25.2 35,32.69 35.84,33.53 v1(38.05,33.53) 39.29,34.77 v1(39.29,36.65)
  Bottom Layer w0.152: v1(56.06,47.57) 55.42,48.21 50.85,48.21 v1(39.29,36.65) ; v1(38.05,33.53) 36.15,33.53 U2.43
P55: length 20.4
  Top Layer w0.152: H5.8 26.59,48.03 26.59,37.87 25.31,36.59 25.31,34.46 U1.69
P56: length 27.6
  Top Layer w0.152: v1(29.01,37.92) 31.17,40.08 v1(31.93,40.08) 33.39,41.54 v1(34.32,41.54) ; v1(41.96,45.88) 43.25,45.88 ; v1(25.96,37.92) 24.97,36.93 24.97,35.65 24.75,35.43 U1.70
  Bottom Layer w0.152: v1(41.96,45.88) 39.61,43.53 36.31,43.53 v1(34.32,41.54) ; U2.30 32.35,39.66 v1(31.93,40.08) ; v1(25.96,37.92) v1(29.01,37.92)
P82: length 24.1
  Top Layer w0.152: v1(41,36.88) 41.86,36.88 43.61,35.13 43.61,34.62 39.48,30.49 U1.46 ; v1(44.32,40.21) 44.32,41.31 R1.1
  Bottom Layer w0.152: U2.38 40.13,36.02 v1(41,36.88) v1(44.32,40.21)
P96: length 67.6
  Top Layer w0.152: U1.98 14.18,21.49 10.59,25.08 10.59,36.02 9.32,37.29 H1.8
  Bottom Layer w0.152: U2.32 33.29,37.37 33.29,40.22 30.46,43.05 7.8,43.05 5.84,41.1 3.92,41.1 3.3,40.47 3.3,38.56 H1.8
P97: length 61.8
  Top Layer w0.152: v1(9.07,36.65) 10.08,35.64 10.08,24.75 13.84,20.99 U1.99
  Bottom Layer w0.152: U2.31 32.85,39.89 30.17,42.57 8.55,42.57 5.81,39.83 ; 5.81,39.83 H1.6 ; 5.81,39.83 5.89,39.83 v1(9.07,36.65)
SWCLK: length 79.5
  Top Layer w0.152: H1.5 3.29,38.56 9.55,38.56 11.17,36.94 11.17,25.28 13.46,22.99 U1.95
  Bottom Layer w0.152: H1.5 0.74,41.12 0.74,45.72 1.19,46.18 5.82,46.18 7.99,44.01 30.92,44.01 36.14,38.79 U2.37
SWDIO: length 70.3
  Top Layer w0.152: U1.94 13.78,23.49 11.74,25.54 11.74,37.26 7.9,41.1 3.35,41.1 2.08,42.37 H1.3
  Bottom Layer w0.152: H1.3 3.18,43.52 30.69,43.52 35.35,38.86 U2.36
UARTRX_P22: length 9.2
  Top Layer w0.152: U1.18 v1(30.75,16.71) ; U11.1 35.75,14.42 v1(35.74,14.43)
  Bottom Layer w0.152: v1(30.75,16.71) 33.45,16.71 v1(35.74,14.43)
UARTTX_P23: length 5.8
  Top Layer w0.152: U1.19 v1(31.25,17.35)
  Top Layer w0.203: v1(34.21,16.97) 34.97,16.21 U11.2
  Bottom Layer w0.203: v1(31.25,17.35) 33.83,17.35 v1(34.21,16.97)
$1N8123: length 13.5
  Bottom Layer w0.203: C4.2 28.09,23.18 X2.2 30.59,23.7 32.85,25.96 U2.6
$1N8134: length 13.6
  Bottom Layer w0.203: U2.5 33.35,25.96 35.61,23.7 X2.1 38.13,23.16 C3.2
$1N11130: length 7.5
  Top Layer w0.203: U1.86 18.28,27.49 17.14,26.35 15.71,26.35 14.14,24.77 13.98,24.77
$1N11324: length 7.2
  Top Layer w0.203: U1.85 18.74,27.99 17.63,29.11 X1.1 14.48,30.69 C2.1
$2N128: length 2.6
  Top Layer w0.305: 12.76,49.63 12.75,49.63 12.75,52.27
$2N378: length 5.6
  Top Layer w0.305: BUZZER1.2 31.29,47.45 Q2.3
$2N380: length 1.9
  Top Layer w0.152: R6.2 27.95,43.37 27.95,44.98
$2N829: length 9.6
  Top Layer w0.305: Q1.3 50.47,42.11 52.73,44.37 52.73,47.78 53.05,48.1 FPC1.1
$2N830: length 1.9
  Top Layer w0.152: Q1.1 44.57,43.06 R1.2
$2N1066: length 3.7
  Top Layer w0.203: C14.1 56.6,32.86
$2N4188: length 5.2
  Top Layer w0.152: LED1.2 47.13,48.88 45.75,50.26 H9.2
$3N440: length 2.3
  Top Layer w0.406: C23.1 67.47,32.68 66.26,32.68
$3N443: length 4.3
  Top Layer w0.305: U6.3 64.31,32.68 R13.2 R12.1
$3N445: length 1.8
  Top Layer w0.203: 62.57,30.5 64.24,30.5 U6.4
$3N604: length 8.1
  Top Layer w0.762: U9.6 32.56,6.3 31.04,4.78 29.11,4.78 CN1.1
$3N605: length 7.8
  Top Layer w0.762: U9.8 37.43,7.27 39.45,5.26 CN1.6
$3N842: length 6.1
  Top Layer w0.305: Q3.1 77.79,20.4 77.79,23.13 D2.1 77.48,24.65 R10.1
$3N843: length 15.1
  Top Layer w2.032: D1.2 73.74,11 Q3.4
  Top Layer w5.995: Q3.4 75.78,5.03 U5.1
$3N2408: length 8.3
  Top Layer w0.762: CN2.1 11.07,4.78 12.88,4.78 14.53,6.43 14.53,7.58
$3N2409: length 8
  Top Layer w0.762: U10.8 19.22,7.58 21.41,5.38 CN2.6
$3N3839: length 3.8
  Top Layer w0.305: R14.1 R15.2 83.91,28.87 U7.4
$3N3841: length 2
  Top Layer w0.406: U7.6 82.52,30.84 C25.1
$3N4184: length 3.6
  Top Layer w0.203: R11.1 81.84,27.06 81.34,27.57 81.34,29.05 82.11,29.82 U7.5

## Copper pours and planes (outline as drawn; the poured copper is in the pictures)
D5V on Top Layer: 71.68,37.67 74.22,37.67 74.22,35.13 71.68,35.13
D5V on Top Layer: 20.39,46.47 21.73,46.47 21.73,45.13 20.39,45.13
D5V on Top Layer: 75.77,37.81 81.57,37.81 81.57,34.25 75.77,34.25
D5V on 电源: 20.39,46.47 21.73,46.47 21.73,45.13 20.39,45.13
D5V on 电源: 71.68,37.67 74.22,37.67 74.22,35.13 71.68,35.13
GND on Top Layer: 64.34,35.11 65.68,35.11 65.68,33.78 64.34,33.78
GND on Top Layer: 71.2,22.35 75.78,22.35 75.78,17.87 71.2,17.87
GND on Top Layer: 60.51,28.97 62.42,28.97 62.42,27.63 60.51,27.63
GND on Top Layer: 27.96,11.54 29.3,11.54 29.3,10.2 27.96,10.2
GND on Top Layer: 73.53,32.76 74.87,32.76 74.87,31.42 73.53,31.42
GND on 地: 0.26,53.74 85.44,53.74 85.44,0.26 0.26,0.26
B12V on Top Layer: 22.92,8.48 25.54,8.48 25.54,7.12 22.92,7.12
B12V on Top Layer: 8.83,8.48 10.17,8.48 10.17,7.14 8.83,7.14
$3N441 on Top Layer: 65.94,31.39 72.96,31.39 72.96,29.78 65.94,29.78
$3N3836 on Top Layer: 75.78,33.72 81.68,33.72 81.68,31.71 75.78,31.71
$3N3836 on Top Layer: 79.14,31.86 81.68,31.86 81.68,29.45 79.14,29.45

Small or netless copper shapes (teardrops, artwork), in the pictures only: 439 on Top Layer, 189 on Bottom Layer, 61 on 电源, 56 on 地

## Text on the board
Top Silkscreen Layer: JLCJLCJLCJLC | 5V | 3.3V | UART | G | T | R | 5V / 3.3V / GND | 🔺 | OLED | M2 | Debug | ADC | MSP432 | M1 | I2C | RGB | MAG | IMU
